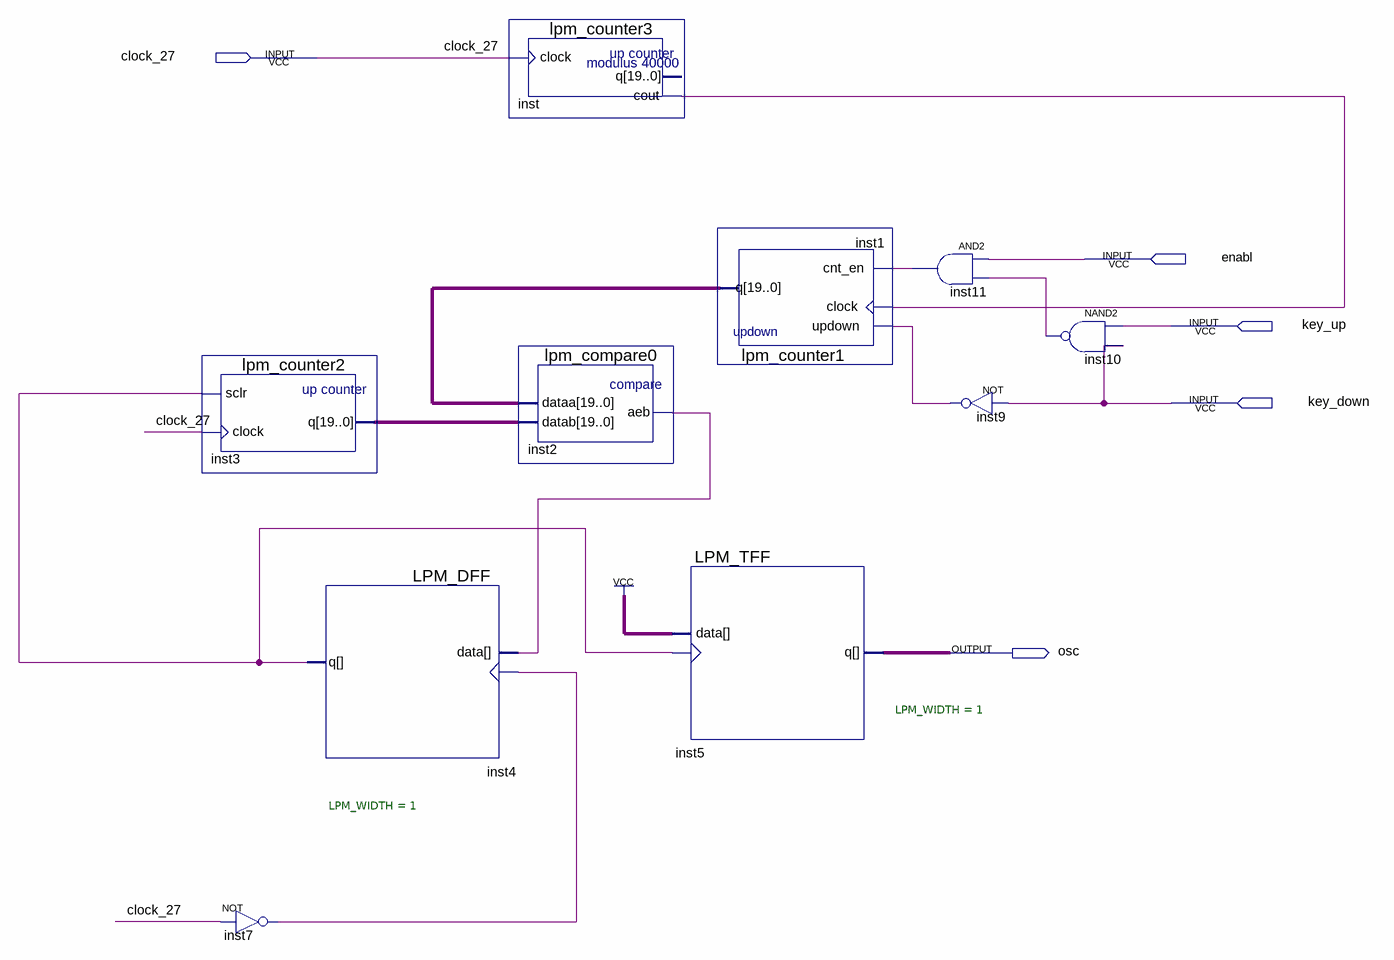
[diagram p0: schematic sheet]
// Quartus schematic geradorOsc.bdf as structural Verilog: 10 symbols, 5 pins
module geradorOsc (
  input  clock_27,
  input  enabl,
  input  key_up,
  input  key_down,
  output osc
);

  wire inst2_aeb, inst4_q, inst7_out, inst9_out, inst10_out, inst11_out, inst_cout;
  wire [19:0] inst1_q, inst3_q;

  lpm_counter2 inst3 (.sclr(inst4_q), .clock(clock_27), .q(inst3_q));
  not inst7 (inst7_out, clock_27);
  LPM_DFF #(.LPM_WIDTH(1)) inst4 (.clock(inst7_out), .data(inst2_aeb), .q(inst4_q));
  lpm_counter3 inst (.clock(clock_27), .cout(inst_cout));  // open: q
  lpm_compare0 inst2 (.dataa(inst1_q), .datab(inst3_q), .aeb(inst2_aeb));
  lpm_counter1 inst1 (.updown(inst9_out), .clock(inst_cout), .cnt_en(inst11_out), .q(inst1_q));
  LPM_TFF #(.LPM_WIDTH(1)) inst5 (.clock(inst4_q), .data(1'b1), .q(osc));
  and inst11 (inst11_out, enabl, inst10_out);
  not inst9 (inst9_out, key_down);
  nand inst10 (inst10_out, key_up, key_down);
endmodule
